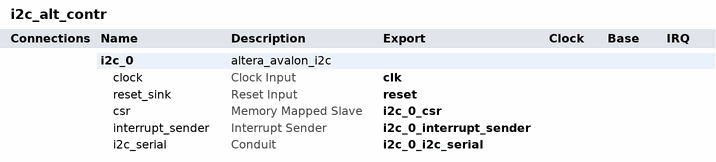
[diagram p0: system contents]
# Platform Designer (Qsys) system i2c_alt_contr, Cyclone V 5CGXFC5C6F27C7
# Parameters at their usual value, and those the tool derives, are not listed.
package require -exact qsys 21.1
create_system i2c_alt_contr
set_project_property DEVICE_FAMILY {Cyclone V}
set_project_property DEVICE 5CGXFC5C6F27C7

add_instance i2c_0 altera_avalon_i2c 21.1
set_instance_parameter_value i2c_0 FIFO_DEPTH 4

# exported interfaces
add_interface clk clock sink
set_interface_property clk EXPORT_OF i2c_0.clock
add_interface i2c_0_csr avalon slave
set_interface_property i2c_0_csr EXPORT_OF i2c_0.csr
add_interface i2c_0_i2c_serial conduit end
set_interface_property i2c_0_i2c_serial EXPORT_OF i2c_0.i2c_serial
add_interface i2c_0_interrupt_sender interrupt sender
set_interface_property i2c_0_interrupt_sender EXPORT_OF i2c_0.interrupt_sender
add_interface reset reset sink
set_interface_property reset EXPORT_OF i2c_0.reset_sink

set_interconnect_requirement {$system} qsys_mm.clockCrossingAdapter HANDSHAKE
set_interconnect_requirement {$system} qsys_mm.enableEccProtection FALSE
set_interconnect_requirement {$system} qsys_mm.insertDefaultSlave FALSE
set_interconnect_requirement {$system} qsys_mm.maxAdditionalLatency 1

save_system i2c_alt_contr.qsys
